# EAGLE design amp_schematic (EAGLE 9.4.0)
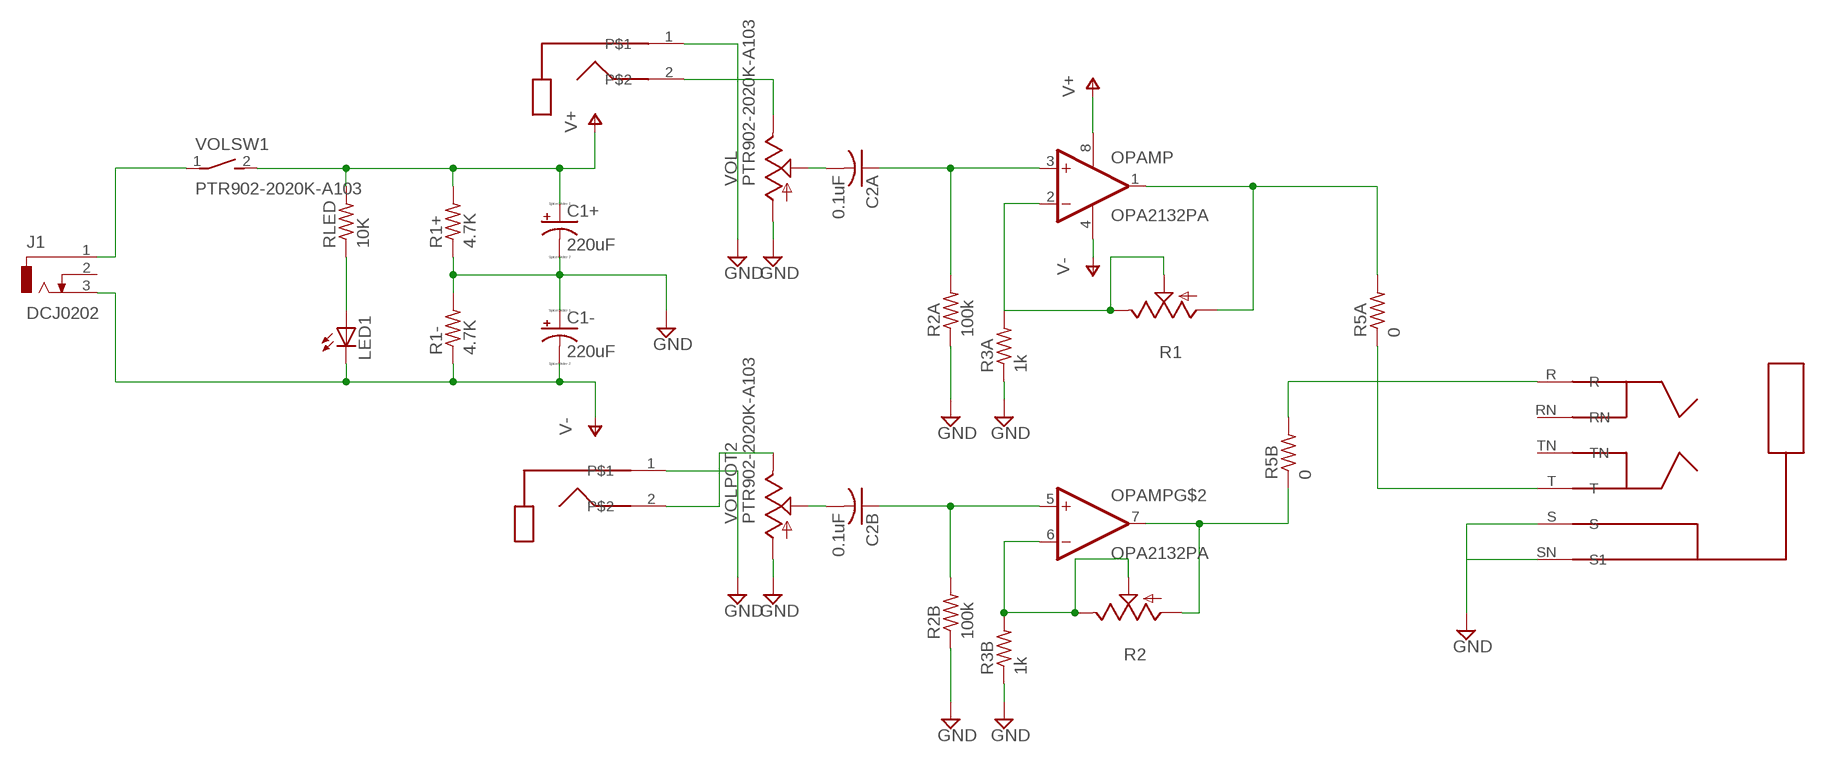
[diagram p0: schematic, sheet 1]

## Parts
C1+  220uF  CPOL-USE3.5-8  [E3,5-8]
C1-  220uF  CPOL-USE3.5-8  [E3,5-8]
C2A  0.1uF  C-US050-025X075  [C050-025X075]
C2B  0.1uF  C-US050-025X075  [C050-025X075]
J1  DCJ0202  [DCJ0202]
LED1  LED5MM  [LED5MM]
LEFT  RCAJACK  [RCAJACK]
OPAMP  OPA2132PA  [DIP254P762X508-8]
OUTPUT  STEROJACK  [STEREOJACK]
R1  TRIM_US-B25U  [B25U]
R1+  4.7K  R-US_0204/2V  [0204V]
R1-  4.7K  R-US_0204/2V  [0204V]
R2  TRIM_US-B25U  [B25U]
R2A  100k  R-US_0204/2V  [0204V]
R2B  100k  R-US_0204/2V  [0204V]
R3A  1k  R-US_0204/2V  [0204V]
R3B  1k  R-US_0204/2V  [0204V]
R5A  0  R-US_0204/2V  [0204V]
R5B  0  R-US_0204/2V  [0204V]
RIGHT  RCAJACK  [RCAJACK]
RLED  10K  R-US_0204/2V  [0204V]
VOL  PTR902-2020K-A103  [PTR902]

## Nets
GND: C1+.- C1-.+ LEFT.1 OUTPUT.S OUTPUT.SN(S1) R1+.1 R1-.2 R2A.1 R2B.1 R3A.1 R3B.1 RIGHT.1 VOL.1A(A) VOL.1B(A)
N$1: LED1.A RLED.1
N$2: C2A.2 VOL.2A(S)
N$3: C2B.1 OPAMP.5(+INB) R2B.2
N$4: C2A.1 OPAMP.3(+INA) R2A.2
N$5: OPAMP.2(-INA) R1.E R1.S R3A.2
N$6: C2B.2 VOL.2B(S)
N$7: OPAMP.6(-INB) R2.E R2.S R3B.2
N$8: LEFT.2 VOL.3A(E)
N$9: OUTPUT.R R5B.2
N$11: OUTPUT.T R5A.1
N$12: RIGHT.2 VOL.3B(E)
N$13: OPAMP.7(OUTB) R2.A R5B.1
N$15: OPAMP.1(OUTA) R1.A R5A.2
SW1: J1.1 VOL.1(P)
V+: C1+.+ OPAMP.8(V+) R1+.2 RLED.2 VOL.2(S)
V-: C1-.- J1.3 LED1.K(C) OPAMP.4(V-) R1-.1
Unconnected: J1.2 OUTPUT.RN OUTPUT.TN

## Library data of the parts
C1+ C1- = resistor:CPOL-US: POLARIZED CAPACITOR, American symbol
C2A C2B = rcl:C-US: CAPACITOR, American symbol; SPICEPREFIX: C
J1 = con-jack:DCJ0202: DC POWER JACK Source: DCJ0202.pdf; OC_FARNELL: unknown; OC_NEWARK: unknown
LED1 = led:LED: LED OSRAM: - CHIPLED LG R971, LG N971, LY N971, LG Q971, LY Q971, LO R971, LY R971 LH N974, LH R974 LS Q976, LO Q976, LY Q976 LO Q996 - Hyper CHIPLED LW Q18S LB Q993, LB Q99A, LB R99A - SideLED LS A670, LO A670, LY A670, LG A670, LP A670 LB A673, LV A673, LT A673, LW A673 LH A674 LY A675 LS A676, LA A676, LO A676, LY A676, LW A676 LS A679, LY A679, LG A679 - Hyper Micro SIDELED® LS Y876, LA Y876, LO Y876, LY Y876 LT Y87S - SmartLED LW L88C, LW L88S LB L89C, LB L89S, LG L890 LS L89K, LO L89K, LY L89K LS L896, LA L896, LO L896, LY L896 - TOPLED LS T670, LO T670, LY T670, LG T670, LP T670 LSG T670, LSP T670, LSY T670, LOP T670, LYG T670 LG T671, LOG T671, LSG T671 LB T673, LV T673, LT T673, LW T673 LH T674 LS T676, LA T676, LO T676, LY T676, LB T676, LH T676, LSB T676, LW T676 LB T67C, LV T67C, LT T67C, LS T67K, LO T67K, LY T67K, LW E67C LS E67B, LA E67B, LO E67B, LY E67B, LB E67C, LV E67C, LT E67C LW T67C LS T679, LY T679, LG T679 LS T770, LO T770, LY T770, LG T770, LP T770 LB T773, LV T773, LT T773, LW T773 LH T774 LS E675, LA E675, LY E675, LS T675 LS T776, LA T776, LO T776, LY T776, LB T776 LHGB T686 LT T68C, LB T68C - Hyper Mini TOPLED® LB M676 - Mini TOPLED Santana® LG M470 LS M47K, LO M47K, LY M47K Source: http://www.osram.convergy.de LUXEON: - LUMILED® LXK2-PW12-R00, LXK2-PW12-S00, LXK2-PW14-U00, LXK2-PW14-V00 LXK2-PM12-R00, LXK2-PM12-S00, LXK2-PM14-U00 LXK2-PE12-Q00, LXK2-PE12-R00, LXK2-PE12-S00, LXK2-PE14-T00, LXK2-PE14-U00 LXK2-PB12-K00, LXK2-PB12-L00, LXK2-PB12-M00, LXK2-PB14-N00, LXK2-PB14-P00, LXK2-PB14-Q00 LXK2-PR12-L00, LXK2-PR12-M00, LXK2-PR14-Q00, LXK2-PR14-R00 LXK2-PD12-Q00, LXK2-PD12-R00, LXK2-PD12-S00 LXK2-PH12-R00, LXK2-PH12-S00 LXK2-PL12-P00, LXK2-PL12-Q00, LXK2-PL12-R00 Source: www.luxeon.com KINGBRIGHT: KA-3528ASYC Source: www.kingbright.com
LEFT RIGHT = OPA2132PA:RCAJACK
OPAMP = OPA2132PA:OPA2132PA: OPERATIONAL AMPLIFIER; DESCRIPTION: Operational amplifier; 8MHz; 2.5÷18VDC; Channels: 2; DIP8; DIGI-KEY_PART_NUMBER: OPA2132PA-ND; DIGI-KEY_PURCHASE_URL: https://www.digikey.com/product-detail/en/texas-instruments/OPA2132PA/OPA2132PA-ND/301149?utm_source=snapeda&utm_medium=aggregator&utm_campaign=symbol; MF: Texas Instruments; MP: OPA2132PA; PACKAGE: PDIP-8 Texas Instruments
OUTPUT = OPA2132PA:STEROJACK
R1 R2 = pot:TRIM_US-: POTENTIOMETER
R1+ R1- R2A R2B R3A R3B R5A R5B RLED = resistor:R-US_: RESISTOR, American symbol
VOL = OPA2132PA:PTR902-2020K-A103

## Board
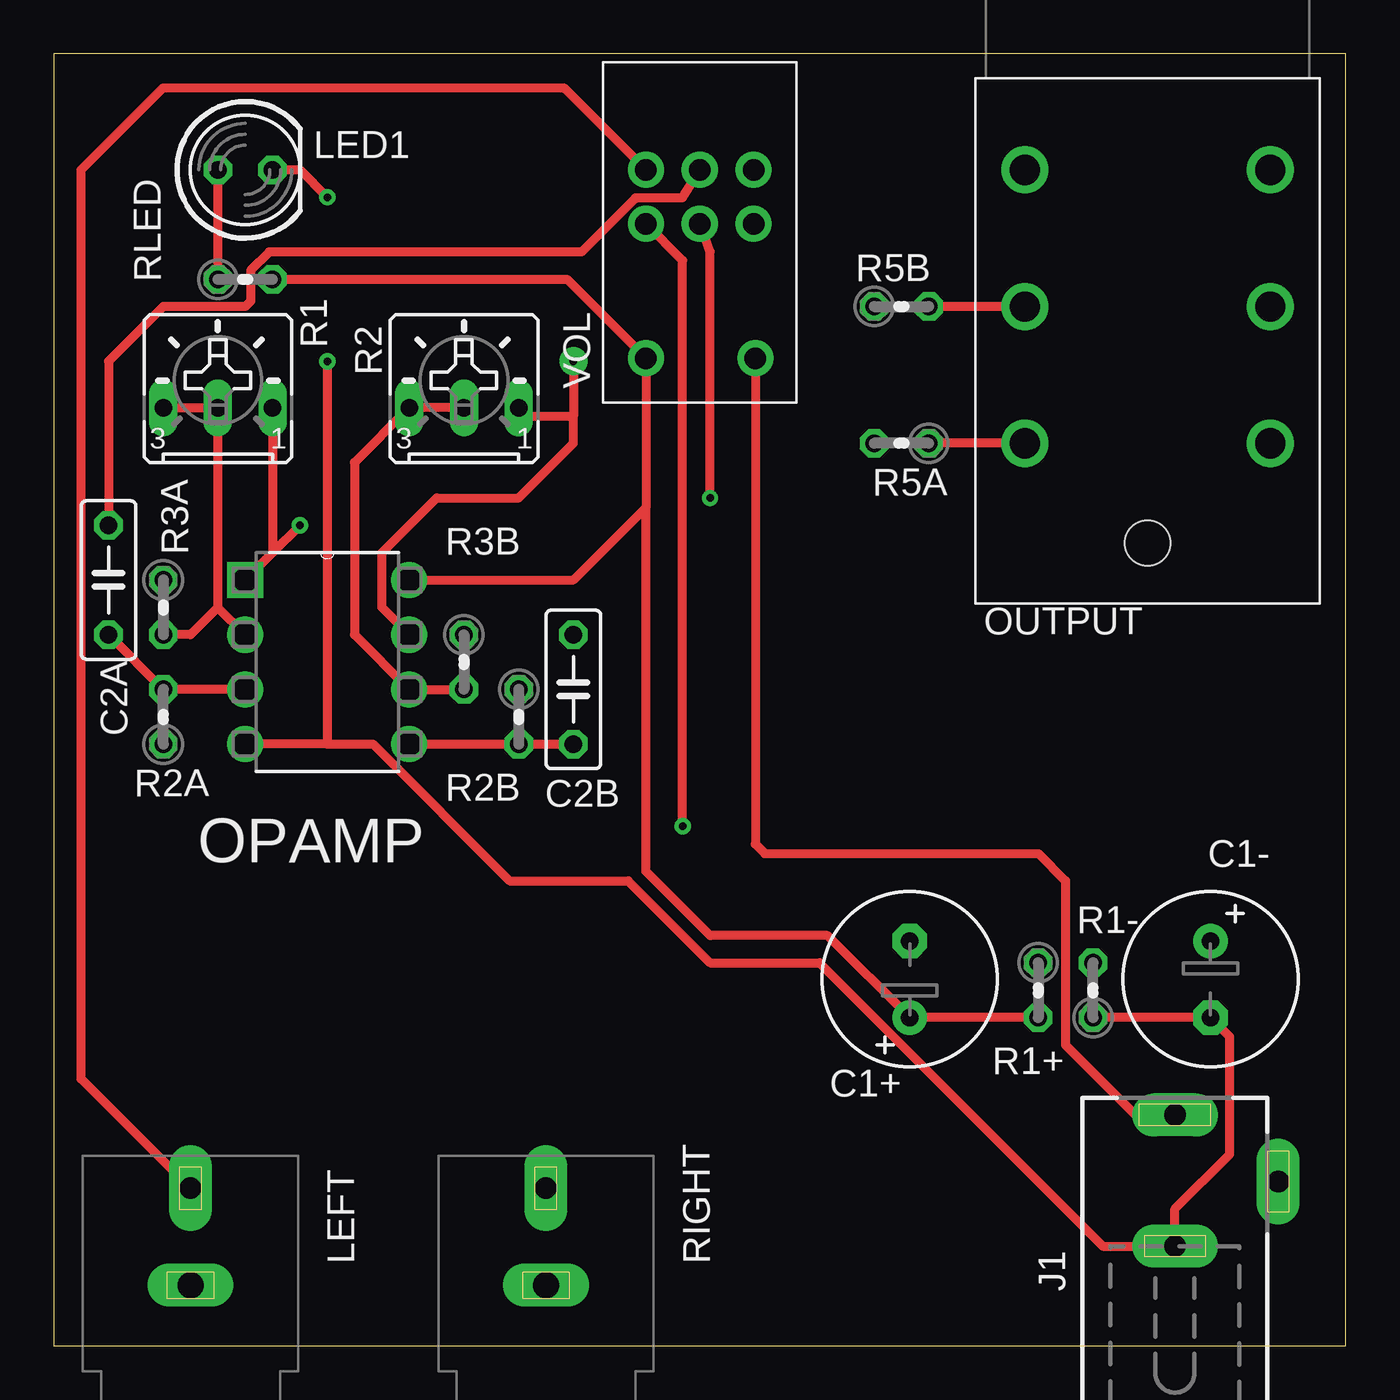
[diagram p1: board, top side]
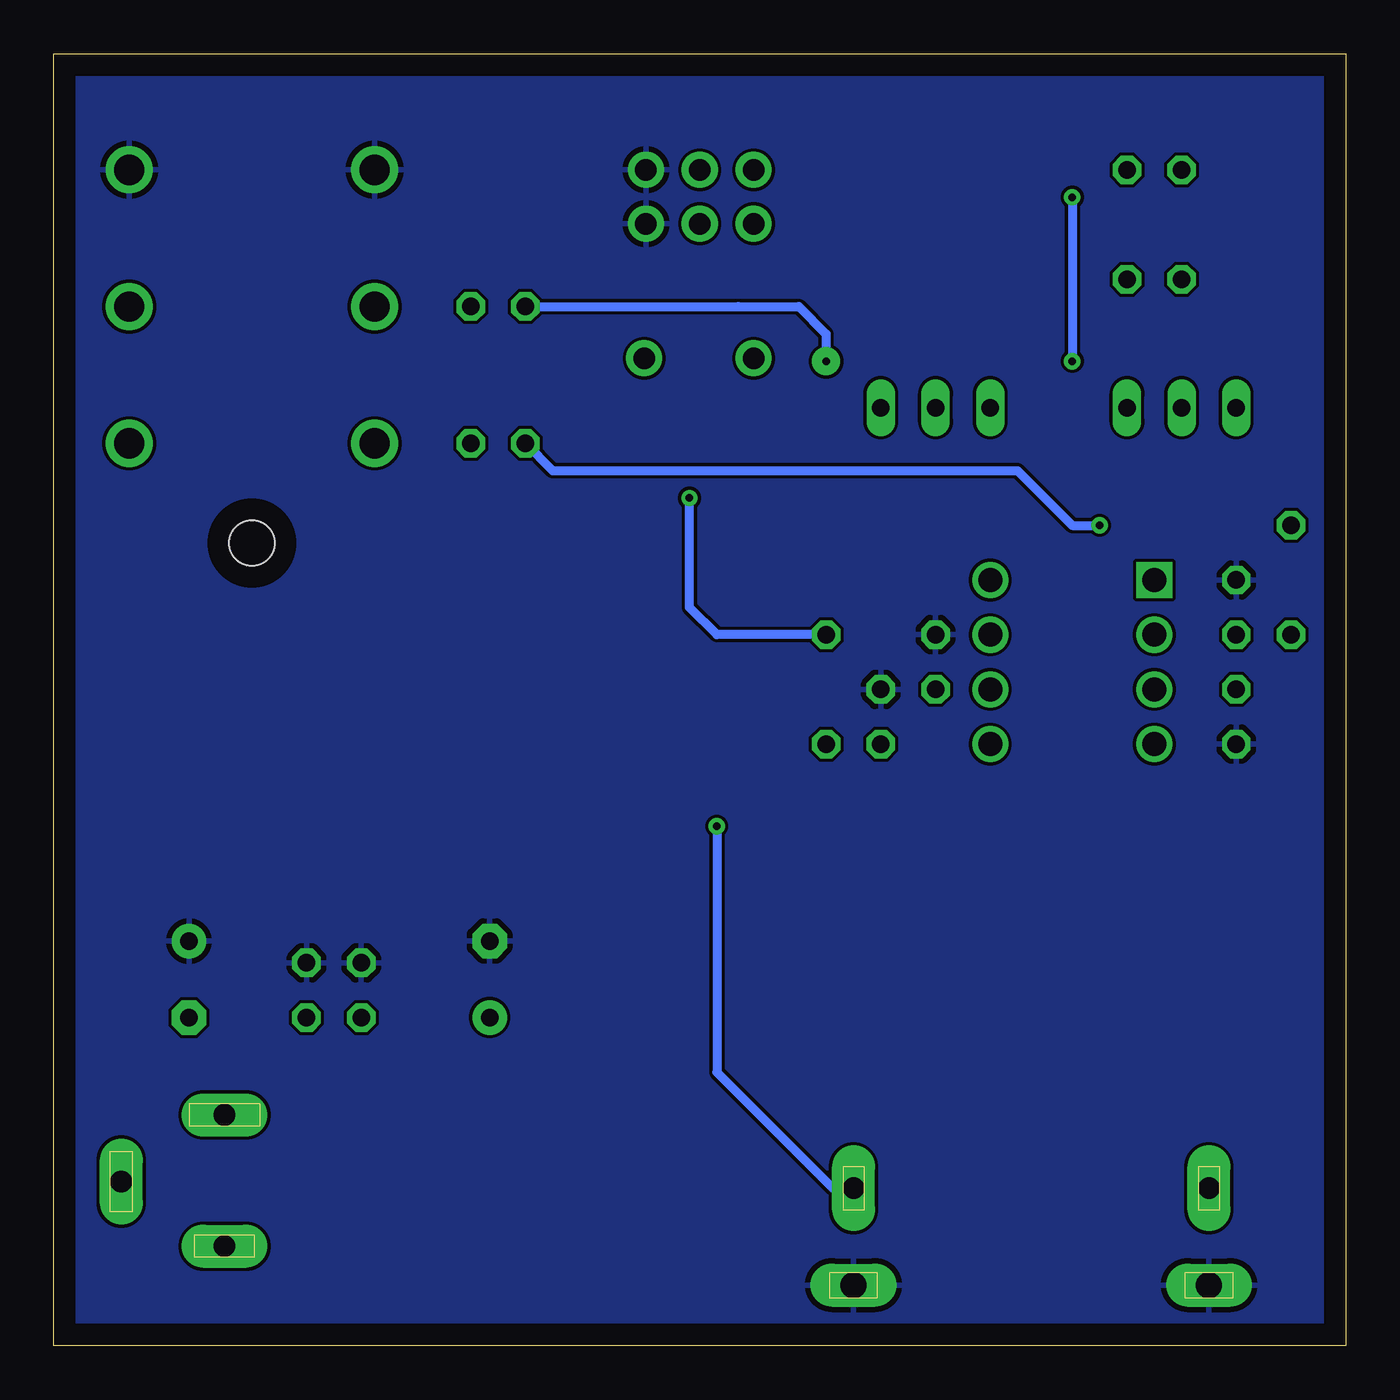
[diagram p2: board, bottom side, seen from below]

Size 60 x 60 mm. Coordinates in mm from the lower left corner, seen from the top.
Outline: 0,0 60,0 60,60 0,60 0,0
Copper layers (1*16): Top 0.035mm / dielectric 1.5mm / Bottom 0.035mm
Design rules "default": minimum track width 6mil, minimum drill 0.35mm, track to track 6mil, track to pad 6mil, pad to pad 6mil, via to via 6mil, smd to smd 6mil, copper to edge 40mil, drill to drill 6mil, minimum pad ring 10mil, minimum via ring 8mil, stop-mask expansion 4mil, vias tented up to drill 0mil, thermal gap 10mil

### Footprints (pad centres in the part's own frame; a part is rotated, then mirrored left to right if it is on the bottom)
E3,5-8 = drill 0.813 pad 1.6: + -1.778,0 | drill 0.813 pad 1.6 octagon: - 1.778,0
C050-025X075 = drill 0.813 octagon: 1 -2.54,0; 2 2.54,0
DCJ0202 = drill 1 pad 2 long: 1 0,3.1; 2 4.8,0; 3 0,-3
LED5MM = drill 0.813 octagon: A -1.27,0; K 1.27,0
RCAJACK = drill 1.2 pad 2 long: 1 -1,0 | drill 1 pad 2 long: 2 3.5,0
DIP254P762X508-8 = drill 1.118 square: 1 -7.62,7.62 | drill 1.118: 2 -7.62,5.08; 3 -7.62,2.54; 4 -7.62,0; 5 0,0; 6 0,2.54; 7 0,5.08; 8 0,7.62
STEREOJACK = drill 1.4 pad 2.184: R -6.35,5.7; RN -6.35,-5.7; S 0,5.7; SN 0,-5.7; T -12.7,5.7; TN -12.7,-5.7 | hole 2.1: -17.33,0
B25U = drill 0.813 long: A 2.54,-0.889; E -2.54,-0.889; S 0,-0.889
0204V = drill 0.813 octagon: 1 -1.27,0; 2 1.27,0
PTR902 = drill 1 pad 1.676: 1 -8.75,-2.58; 1A 0,-2.5; 1B -2.5,-2.5; 2 -8.75,2.5; 2A 0,0; 2B -2.5,0; 3A 0,2.5; 3B -2.5,2.5

### Placement (x,y rotation side)
C1+  39.75,17.02 90 top
C1-  53.72,17.02 270 top
C2A  2.54,35.56 90 top
C2B  24.13,30.48 90 top
J1  52.07,7.62 0 top
LED1  8.89,54.61 0 top
LEFT  6.35,3.81 90 top
OPAMP  16.51,27.94 0 top
OUTPUT  50.8,54.61 90 top
R1  7.62,44.45 0 top
R1+  45.72,16.51 270 top
R1-  48.26,16.51 90 top
R2  19.05,44.45 0 top
R2A  5.08,29.21 90 top
R2B  21.59,29.21 270 top
R3A  5.08,34.29 270 top
R3B  19.05,31.75 270 top
R5A  39.37,41.91 180 top
R5B  39.37,48.26 0 top
RIGHT  22.86,3.81 90 top
RLED  8.89,49.53 0 top
VOL  30,54.61 90 top

### Tracks (layer width: path | path; a pad name or v marks a point on that pad's centre or on a via)
GND
  pour Bottom: 0,59.69 0,1.27 1.27,0 58.42,0 59.69,1.27 59.69,58.42 58.42,59.69
N$1
  Top 0.406: LED1.A RLED.1
N$2
  Top 0.406: VOL.2A 29.21,53.34 29.17,53.3 27.01,53.3 24.5,50.8 9.99,50.8 9.14,49.95 9.14,48.51 8.89,48.26 5.08,48.26 2.54,45.72 C2A.2
N$3
  Top 0.406: OPAMP.5 R2B.2 C2B.1
N$4
  Top 0.406: OPAMP.3 R2A.2 C2A.1
N$5
  Top 0.406: R1.E R1.S 7.62,34.29 | 7.62,34.29 OPAMP.2 | 7.62,34.29 6.35,33.02 R3A.2
N$6  (via drill 0.35)
  Top 0.406: v30.48,39.37 30.48,50.8 VOL.2B
  Bottom 0.406: C2B.2 29.21,33.02 30.48,34.29 v30.48,39.37
N$7
  Top 0.406: R2.S R2.E 13.97,41.02 13.97,33.02 OPAMP.6 R3B.2
N$8
  Top 0.406: LEFT.2 1.27,12.39 1.27,54.61 5.08,58.42 23.69,58.42 VOL.3A
N$9
  Top 0.406: OUTPUT.R R5B.2
N$11
  Top 0.406: OUTPUT.T R5A.1
N$12  (via drill 0.35)
  Top 0.406: v29.21,24.13 29.21,50.4 VOL.3B
  Bottom 0.406: v29.21,24.13 29.21,12.7 23.82,7.31 RIGHT.2
N$13  (via drill 0.35 pad 1.3)
  Top 0.406: R2.A 21.97,43.18 24.13,43.18 | OPAMP.7 15.24,34.29 15.24,36.83 17.78,39.37 21.59,39.37 24.13,41.91 24.13,43.18 | v24.13,45.72 24.13,43.18
  Bottom 0.406: R5B.1 28.21,48.26 25.4,48.26 24.13,46.99 v24.13,45.72
N$15  (via drill 0.35)
  Top 0.406: R1.A 10.16,36.83 | 10.16,36.83 OPAMP.1 | v11.43,38.1 10.16,36.83
  Bottom 0.406: R5A.2 36.83,40.64 15.24,40.64 12.7,38.1 v11.43,38.1
SW1
  Top 0.406: J1.1 50.24,10.72 46.99,13.97 46.99,21.59 45.72,22.86 33.02,22.86 32.58,23.3 VOL.1
V+
  Top 0.406: R1+.2 C1+.+ 35.94,19.05 30.48,19.05 27.5,22.03 27.5,38.93 | 27.5,38.93 VOL.2 23.83,49.53 RLED.2 | OPAMP.8 24.13,35.56 27.5,38.93
V-  (via drill 0.35)
  Top 0.406: R1-.1 C1-.- 54.61,14.35 54.61,8.89 52.07,6.35 J1.3 48.72,4.62 35.56,17.78 30.48,17.78 26.67,21.59 21.17,21.59 14.82,27.94 12.7,27.94 | 12.7,27.94 OPAMP.4 | LED1.K 11.43,54.61 v12.7,53.34 | v12.7,45.72 12.7,27.94
  Bottom 0.406: v12.7,53.34 v12.7,45.72